# Altium project Axiom_Gamma_LSB.PrjPcb
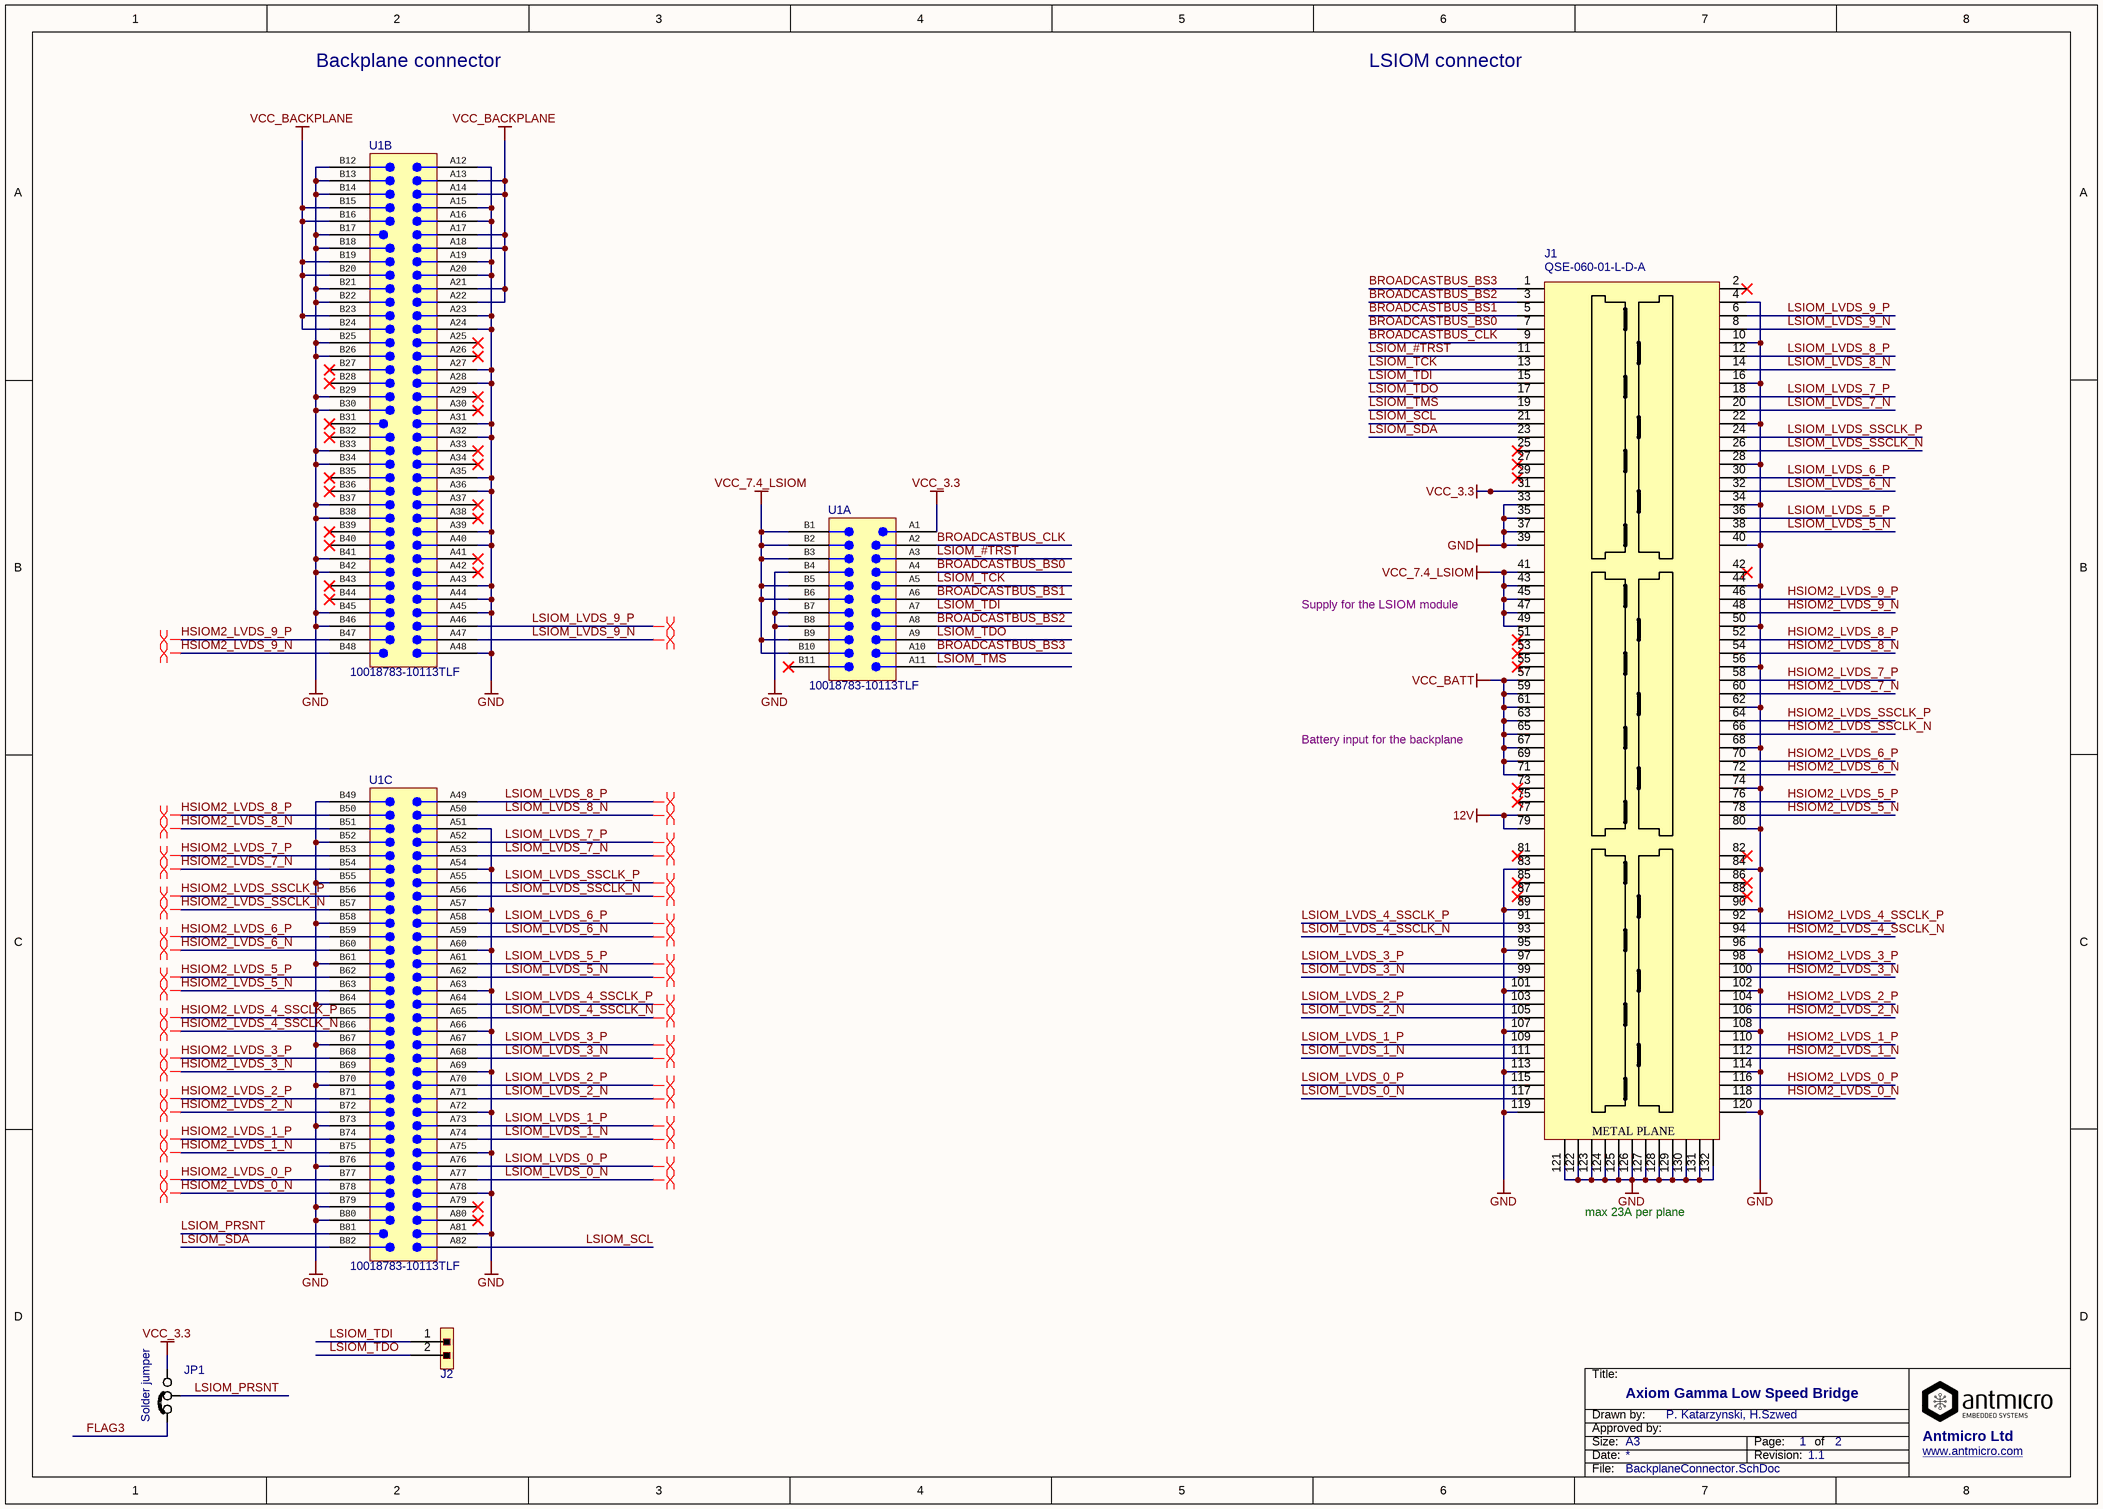
[diagram p0: BackplaneConnector.SchDoc]
AM_Title: Axiom Gamma Low Speed Bridge; AM_Revision: 1.1; AM_Author: P. Katarzynski, H.Szwed
2 sheets, 63 parts. Net scope: global (net labels, ports and power ports of the same name join across sheets).
Board file: Axiom_Gamma_LSB.PcbDoc
Sheets:
  BackplaneConnector.SchDoc
  Supply.SchDoc

## Sheet BackplaneConnector.SchDoc: =AM_Title
size A3; Author: P. Katarzynski, H.Szwed; CompanyName: Antmicro Ltd; Address1: Zwierzyniecka 3; Address2: 60-813 Poznań; Address3: Poland; Address4: 60-813 Poznań, Poland; DocumentNumber: 1; Revision: 1.1; SheetNumber: 1; SheetTotal: 2; PageSetup: Record=PageOptions|CenterHorizontal=True|CenterVertical=True|PrintScale=0.97|XCorrection=1.00|YCorrection=1.00|PrintKind=1|BorderSize=5000000|LeftOffset=0|BottomOffset=0|Orientation=2|PaperLength=2970|PaperWidth=2100|Scale=100|PaperSource=7|PrintQuality=600|MediaType=1|DitherType=10|PaperKind=A4|PrintScaleMode=1

### Parts
J1  QSE-060-01-L-D-A  [QSE-060-01-L-D-A]
J2  1x2 pinhead 2.54mm male  [HEADER_1X2_male 2.54mm Angle]  (value not drawn)
JP1  Solder jumper  [JUMPER_2WAY]  (no BOM)
U1  10018783-10113TLF  [10018783-10113TLF]  (parts A,B,C of 3)

### Nets
12V: J1.77 J1.79
GND: J1.4 J1.10 J1.16 J1.22 J1.28 J1.33 J1.34 J1.35 J1.37 J1.39 J1.40 J1.44 J1.50 J1.56 J1.62 J1.68 J1.74 J1.80 J1.83 J1.84 J1.89 J1.90 J1.95 J1.96 J1.101 J1.102 J1.107 J1.108 J1.113 J1.114 J1.119 J1.120 J1.121 J1.122 J1.123 J1.124 J1.125 J1.126 J1.127 J1.128 J1.129 J1.130 J1.131 J1.132 U1.A12 U1.A15 U1.A16 U1.A19 U1.A20 U1.A23 U1.A24 U1.A27 U1.A28 U1.A31 U1.A32 U1.A35 U1.A36 U1.A39 U1.A40 U1.A43 U1.A44 U1.A45 U1.A48 U1.A51 U1.A54 U1.A57 U1.A60 U1.A63 U1.A66 U1.A69 U1.A72 U1.A75 U1.A78 U1.A81 U1.B4 U1.B7 U1.B8 U1.B12 U1.B13 U1.B14 U1.B17 U1.B18 U1.B21 U1.B22 U1.B25 U1.B26 U1.B29 U1.B30 U1.B33 U1.B34 U1.B37 U1.B38 U1.B41 U1.B42 U1.B45 U1.B46 U1.B49 U1.B52 U1.B55 U1.B58 U1.B61 U1.B64 U1.B67 U1.B70 U1.B73 U1.B76 U1.B79 U1.B80
VCC_3.3: J1.31 JP1.3 U1.A1
VCC_7.4_LSIOM: J1.41 J1.43 J1.45 J1.47 J1.49 U1.B1 U1.B2 U1.B3 U1.B5 U1.B6 U1.B9 U1.B10
VCC_BACKPLANE: U1.A13 U1.A14 U1.A17 U1.A18 U1.A21 U1.A22 U1.B15 U1.B16 U1.B19 U1.B20 U1.B23 U1.B24
VCC_BATT: J1.57 J1.59 J1.61 J1.63 J1.65 J1.67 J1.69 J1.71
BROADCASTBUS_BS0: J1.7 U1.A4
BROADCASTBUS_BS1: J1.5 U1.A6
BROADCASTBUS_BS2: J1.3 U1.A8
BROADCASTBUS_BS3: J1.1 U1.A10
BROADCASTBUS_CLK: J1.9 U1.A2
FLAG3: JP1.1
HSIOM2_LVDS_0_N: J1.118 U1.B78
HSIOM2_LVDS_0_P: J1.116 U1.B77
HSIOM2_LVDS_1_N: J1.112 U1.B75
HSIOM2_LVDS_1_P: J1.110 U1.B74
HSIOM2_LVDS_2_N: J1.106 U1.B72
HSIOM2_LVDS_2_P: J1.104 U1.B71
HSIOM2_LVDS_3_N: J1.100 U1.B69
HSIOM2_LVDS_3_P: J1.98 U1.B68
HSIOM2_LVDS_4_SSCLK_N: J1.94 U1.B66
HSIOM2_LVDS_4_SSCLK_P: J1.92 U1.B65
HSIOM2_LVDS_5_N: J1.78 U1.B63
HSIOM2_LVDS_5_P: J1.76 U1.B62
HSIOM2_LVDS_6_N: J1.72 U1.B60
HSIOM2_LVDS_6_P: J1.70 U1.B59
HSIOM2_LVDS_7_N: J1.60 U1.B54
HSIOM2_LVDS_7_P: J1.58 U1.B53
HSIOM2_LVDS_8_N: J1.54 U1.B51
HSIOM2_LVDS_8_P: J1.52 U1.B50
HSIOM2_LVDS_9_N: J1.48 U1.B48
HSIOM2_LVDS_9_P: J1.46 U1.B47
HSIOM2_LVDS_SSCLK_N: J1.66 U1.B57
HSIOM2_LVDS_SSCLK_P: J1.64 U1.B56
LSIOM_#TRST: J1.11 U1.A3
LSIOM_LVDS_0_N: J1.117 U1.A77
LSIOM_LVDS_0_P: J1.115 U1.A76
LSIOM_LVDS_1_N: J1.111 U1.A74
LSIOM_LVDS_1_P: J1.109 U1.A73
LSIOM_LVDS_2_N: J1.105 U1.A71
LSIOM_LVDS_2_P: J1.103 U1.A70
LSIOM_LVDS_3_N: J1.99 U1.A68
LSIOM_LVDS_3_P: J1.97 U1.A67
LSIOM_LVDS_4_SSCLK_N: J1.93 U1.A65
LSIOM_LVDS_4_SSCLK_P: J1.91 U1.A64
LSIOM_LVDS_5_N: J1.38 U1.A62
LSIOM_LVDS_5_P: J1.36 U1.A61
LSIOM_LVDS_6_N: J1.32 U1.A59
LSIOM_LVDS_6_P: J1.30 U1.A58
LSIOM_LVDS_7_N: J1.20 U1.A53
LSIOM_LVDS_7_P: J1.18 U1.A52
LSIOM_LVDS_8_N: J1.14 U1.A50
LSIOM_LVDS_8_P: J1.12 U1.A49
LSIOM_LVDS_9_N: J1.8 U1.A47
LSIOM_LVDS_9_P: J1.6 U1.A46
LSIOM_LVDS_SSCLK_N: J1.26 U1.A56
LSIOM_LVDS_SSCLK_P: J1.24 U1.A55
LSIOM_PRSNT: JP1.2 U1.B81
LSIOM_SCL: J1.21 U1.A82
LSIOM_SDA: J1.23 U1.B82
LSIOM_TCK: J1.13 U1.A5
LSIOM_TDI: J1.15 J2.1 U1.A7
LSIOM_TDO: J1.17 J2.2 U1.A9
LSIOM_TMS: J1.19 U1.A11

Not connected (* = marked no-connect by the designer): J1 2* 25* 27* 29* 42* 51* 53* 55* 73* 75* 81* 82* 85* 86* 87* 88*; U1 A25* A26* A29* A30* A33* A34* A37* A38* A41* A42* A79* A80* B11* B27* B28* B31* B32* B35* B36* B39* B40* B43* B44*

### Layout directives
differential pair; net class LSIOM_LVDS: HSIOM2_LVDS_0_N, HSIOM2_LVDS_0_P, HSIOM2_LVDS_1_N, HSIOM2_LVDS_1_P, HSIOM2_LVDS_2_N, HSIOM2_LVDS_2_P, HSIOM2_LVDS_3_N, HSIOM2_LVDS_3_P, HSIOM2_LVDS_4_SSCLK_N, HSIOM2_LVDS_4_SSCLK_P, HSIOM2_LVDS_5_N, HSIOM2_LVDS_5_P, HSIOM2_LVDS_6_N, HSIOM2_LVDS_6_P, HSIOM2_LVDS_7_N, HSIOM2_LVDS_7_P, HSIOM2_LVDS_8_N, HSIOM2_LVDS_8_P, HSIOM2_LVDS_9_N, HSIOM2_LVDS_9_P, HSIOM2_LVDS_SSCLK_N, HSIOM2_LVDS_SSCLK_P, LSIOM_LVDS_0_N, LSIOM_LVDS_0_P, LSIOM_LVDS_1_N, LSIOM_LVDS_1_P, LSIOM_LVDS_2_N, LSIOM_LVDS_2_P, LSIOM_LVDS_3_N, LSIOM_LVDS_3_P, LSIOM_LVDS_4_SSCLK_N, LSIOM_LVDS_4_SSCLK_P, LSIOM_LVDS_5_N, LSIOM_LVDS_5_P, LSIOM_LVDS_6_N, LSIOM_LVDS_6_P, LSIOM_LVDS_7_N, LSIOM_LVDS_7_P, LSIOM_LVDS_8_N, LSIOM_LVDS_8_P, LSIOM_LVDS_SSCLK_N, LSIOM_LVDS_SSCLK_P
differential pair: LSIOM_LVDS_9_N, LSIOM_LVDS_9_P

### Notes on the sheet
- Backplane connector
- LSIOM connector
- Supply for the LSIOM module
- Battery input for the backplane
- max 23A per plane
- Title:
- Drawn by:
- Size:
- Date:
- Approved by:
- A3
- Revision:
- Page:
- of
- www.antmicro.com
- File:
- (in symbol QSE-060-01-L-D-A) METAL PLANE

### Library data of the parts
J1 = QSE-060-01-L-D-A: SAMTEC 	QSE-60-01-L-D-A  Stacking Board Connector, Dual Row, QSE Series, Receptacle, 0.8 m, 120 Contacts, Surface Mount; Part Number: QSE-060-01-L-D-A; Value: QSE-060-01-L-D-A; Manufacturer: SAMTEC; Part Symbol: QSE-060-01-L-D-A
J2 = HEADER_1X2_male_angle: 1x2 pinhead male angle; Manufacturer: MULTICOMP; Value: 2211S-02G; Part Number: HEADER_1X2_male_angle; Part Symbol: 2211S-02G
JP1 = Jumper 2 way: Value: Solder
U1 = 10018783-10113TLF: PCI Express x16 164 2.36 mm; Manufacturer: AMPHENOL; Part Symbol: 10018783-10113TLF; Part Number: 10018783-10113TLF; Value: 10018783-10113TLF

## Sheet Supply.SchDoc: =AM_Title
size A3; Author: P. Katarzynski, H.Szwed; CompanyName: Antmicro Ltd; Address1: Zwierzyniecka 3; Address2: 60-813 Poznań; Address3: Poland; Address4: 60-813 Poznań, Poland; DocumentNumber: 2; Revision: 1.1; SheetNumber: 2; SheetTotal: 2; PageSetup: Record=PageOptions|CenterHorizontal=True|CenterVertical=True|PrintScale=0.97|XCorrection=1.00|YCorrection=1.00|PrintKind=1|BorderSize=5000000|LeftOffset=0|BottomOffset=0|Orientation=2|PaperLength=2970|PaperWidth=2100|Scale=100|PaperSource=7|PrintQuality=600|MediaType=1|DitherType=10|PaperKind=A4|PrintScaleMode=1
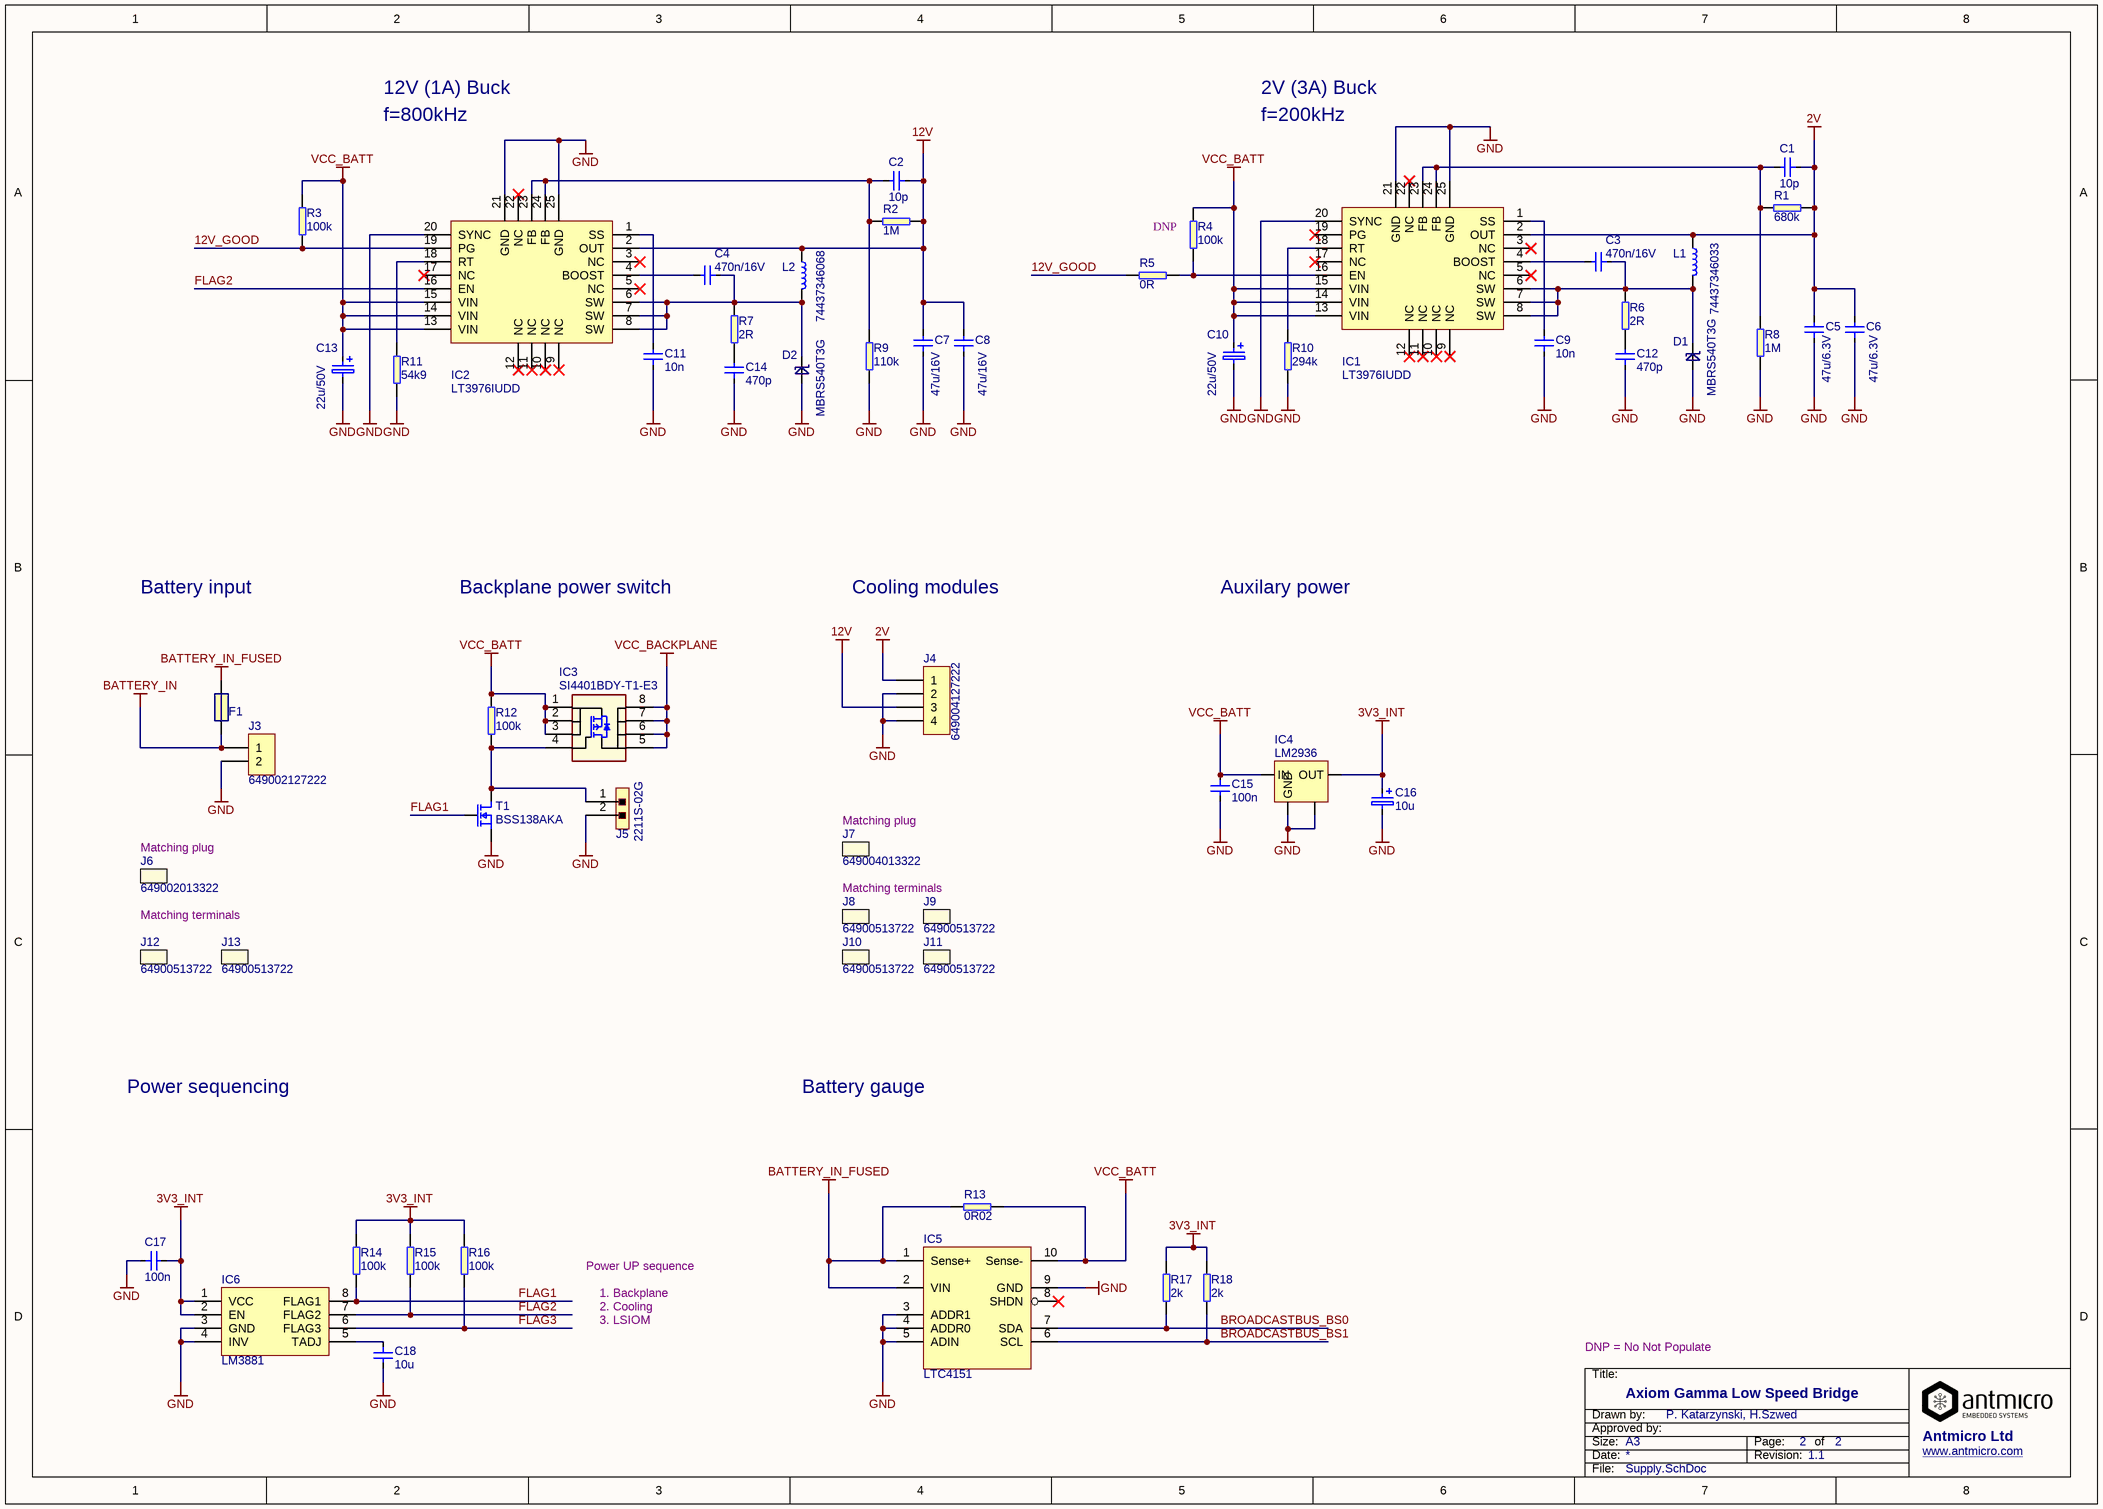
[diagram p1: Supply.SchDoc]

### Parts
C1  10p  [0402]
C2  10p  [0402]
C3  470n/16V  [0402]
C4  470n/16V  [0402]
C5  47u/6.3V  [1206]
C6  47u/6.3V  [1206]
C7  47u/16V  [1206]
C8  47u/16V  [1206]
C9  10n  [0402]
C10  22u/50V  [KEMET_X]
C11  10n  [0402]
C12  470p  [0402]
C13  22u/50V  [KEMET_X]
C14  470p  [0402]
C15  100n  [0603]
C16  10u  [KEMET_A]
C17  100n  [0603]
C18  10u  [0603]
D1  MBRS540T3G  [SMC-403-03]
D2  MBRS540T3G  [SMC-403-03]
F1  MC12CF  [1206]  (value not drawn)
IC1  LT3976IUDD  [QFN-24_3x5mm]
IC2  LT3976IUDD  [QFN-24_3x5mm]
IC3  SI4401BDY-T1-E3  [SOIC-SN8_M]
IC4  LM2936  [SOT223]
IC5  LTC4151  [MSOP10]
IC6  LM3881  [MSOP-8]
J3  649002127222  [WE_649002127222]
J4  649004127222  [WE_649004127222]
J5  value 2211S-02G  [HEADER_1X2_male 2.54mm Angle]  (hidden comment: 1x2 pinhead 2.54mm male)
J6  649002013322  (mechanical)
J7  649004013322  (mechanical)
J8  64900513722  (mechanical)
J9  64900513722  (mechanical)
J10  64900513722  (mechanical)
J11  64900513722  (mechanical)
J12  64900513722  (mechanical)
J13  64900513722  (mechanical)
L1  74437346033  [WE-LHMI]
L2  74437346068  [WE-LHMI]
R1  680k  [0402]
R2  1M  [0603]
R3  100k  [0603]
R4  100k  [0603]
R5  0R  [0603]
R6  2R  [0402]
R7  2R  [0402]
R8  1M  [0603]
R9  110k  [0603]
R10  294k  [0402]
R11  54k9  [0402]
R12  100k  [0603]
R13  0R02  [2512]
R14  100k  [0603]
R15  100k  [0603]
R16  100k  [0603]
R17  2k  [0603]
R18  2k  [0603]
T1  BSS138AKA  [SOT-23]

### Nets
2V: C1.1 C5.2 C6.2 IC1.2(OUT) J4.1 L1.2 R1.2
3V3_INT: C16.1 C17.2 IC4.3(OUT) IC6.1(VCC) IC6.2(EN) R14.2 R15.2 R16.2 R17.2 R18.2
12V: C2.1 C7.2 C8.2 IC2.2(OUT) J4.3 L2.2 R2.1
BATTERY_IN: F1.1 J3.1
BATTERY_IN_FUSED: F1.2 IC5.1(Sense+) IC5.2(VIN) R13.1
GND: C5.1 C6.1 C7.1 C8.1 C9.1 C10.2 C11.1 C12.1 C13.2 C14.1 C15.2 C16.2 C17.1 C18.2 D1.A D2.A IC1.20(SYNC) IC1.21(GND) IC1.25(GND) IC2.20(SYNC) IC2.21(GND) IC2.25(GND) IC4.2(GND) IC4.4(GND) IC5.3(ADDR1) IC5.4(ADDR0) IC5.5(ADIN) IC5.9(GND) IC6.3(GND) IC6.4(INV) J3.2 J4.2 J4.4 J5.2 R8.2 R9.1 R10.1 R11.1 T1.2(S)
VCC_BACKPLANE: IC3.5 IC3.6 IC3.7 IC3.8
VCC_BATT: C10.1 C13.1 C15.1 IC1.13(VIN) IC1.14(VIN) IC1.15(VIN) IC2.13(VIN) IC2.14(VIN) IC2.15(VIN) IC3.1 IC3.2 IC3.3 IC4.1(IN) IC5.10(Sense-) R3.2 R4.2 R12.2 R13.2
12V_GOOD: IC2.19(PG) R3.1 R5.1
BROADCASTBUS_BS0: IC5.7(SDA) R17.1
BROADCASTBUS_BS1: IC5.6(SCL) R18.1
FLAG1: IC6.8(FLAG1) R14.1 T1.1(G)
FLAG2: IC2.16(EN) IC6.7(FLAG2) R15.1
FLAG3: IC6.6(FLAG3) R16.1
NetC1_2: C1.2 IC1.23(FB) IC1.24(FB) R1.1 R8.1
NetC2_2: C2.2 IC2.23(FB) IC2.24(FB) R2.2 R9.2
NetC3_1: C3.1 D1.C IC1.6(SW) IC1.7(SW) IC1.8(SW) L1.1 R6.2
NetC3_2: C3.2 IC1.4(BOOST)
NetC4_1: C4.1 D2.C IC2.6(SW) IC2.7(SW) IC2.8(SW) L2.1 R7.2
NetC4_2: C4.2 IC2.4(BOOST)
NetC9_2: C9.2 IC1.1(SS)
NetC11_2: C11.2 IC2.1(SS)
NetC12_2: C12.2 R6.1
NetC14_2: C14.2 R7.1
NetC18_1: C18.1 IC6.5(TADJ)
NetIC1_16: IC1.16(EN) R4.1 R5.2
NetIC1_18: IC1.18(RT) R10.2
NetIC2_18: IC2.18(RT) R11.2
NetIC3_4: IC3.4 J5.1 R12.1 T1.3(D)

Not connected (* = marked no-connect by the designer): IC1 3(NC)* 5(NC)* 9(NC)* 10(NC)* 11(NC)* 12(NC)* 17(NC)* 19(PG)* 22(NC)*; IC2 3(NC)* 5(NC)* 9(NC)* 10(NC)* 11(NC)* 12(NC)* 17(NC)* 22(NC)*; IC5 8(SHDN)*

### Notes on the sheet
- 12V (1A) Buck
- 2V (3A) Buck
- f=800kHz
- f=200kHz
- (near R4) DNP
- Battery input
- Backplane power switch
- Cooling modules
- Auxilary power
- (near J6) Matching plug
- (near J7) Matching plug
- Matching terminals
- Power sequencing
- Battery gauge
- Power UP sequence
- 1. Backplane
- 2. Cooling
- 3. LSIOM
- DNP = No Not Populate
- Title:
- Drawn by:
- Size:
- Date:
- Approved by:
- A3
- Revision:
- Page:
- of
- www.antmicro.com
- File:

### Library data of the parts
C1-C4 C9 C11 C12 C14 = C_0402: MLCC SMT Capacitor 0402; Part Number: C_10n_0402; Manufacturer: AVX; Part Symbol: 04025G103ZAT2A
  C1 C2: Value: 10p
  C3 C4: Value: 470n/16V
  C9 C11: Value: 10n
  C12 C14: Value: 470p
C5-C8 = C_1206: MLCC SMT Capacitor 1206; Part Number: C_47u_1206; Manufacturer: MURATA; Part Symbol: GRM31CC80J476KE18L
  C5 C6: Value: 47u/6.3V
  C7 C8: Value: 47u/16V
C10 C13 = CPol_X: Tantalum SMT Capacitor Case KEMET_X; Part Number: C_22u_KEMET_X; Manufacturer: KEMET; Part Symbol: T491X226K050AT; Value: 22u/50V
C15 C17 C18 = C_0603: MLCC SMT Capacitor  0603; Part Number: C_10u_0603; Manufacturer: MULTICOMP; Part Symbol: MC0603X106M6R3CT
  C15 C17: Value: 100n
  C18: Value: 10u
C16 = CPol_A: Tantalum SMT Capacitor Case KEMET_A; Part Number: C_10u_KEMET_A; Manufacturer: VISHAY; Part Symbol: 293D106X9016A2TE3; Value: 10u
D1 D2 = MBRS540T3G: ON SEMICONDUCTOR  MBRS540T3G  Rectifier Diode, Single, 40 V, 5 A, 500 mV, 190 A, 150 °C; Part Number: MBRS540T3G; Value: MBRS540T3G; Manufacturer: ON SEMICONDUCTOR; Part Symbol: MBRS540T3G
F1 = MC12CF: MULTICOMP  MC12CF 005  Fuse, Surface Mount, 12CF Series, 5 A, 32 VAC, 63 VDC, Very Fast Acting, 1206; Part Number: MC12CF; Value: MC12CF; Manufacturer: MULTICOMP; Part Symbol: MC12CF
IC1 IC2 = LT3976IUDD: LINEAR TECHNOLOGY  LT3976IUDD#PBF  DC-DC Switching Buck (Step Down) Regulator, Adjustable, 4.3V-40Vin, 1.2V-39.2Vout, 5Aout, QFN-24; Part Number: LT3976IUDD; Value: LT3976IUDD; Manufacturer: LINEAR TECHNOLOGY; Part Symbol: LT3976IUDD#PBF
IC3 = SI4401BDY-T1-E3: VISHAY  SI4401BDY-T1-E3  MOSFET Transistor, P Channel, -8.7 A, -40 V, 0.011 ohm, -10 V, -3 V; Part Number: SI4401BDY-T1-E3; Value: SI4401BDY-T1-E3; Manufacturer: VISHAY; Part Symbol: SI4401BDY-T1-E3
IC4 = LM2936: TEXAS INSTRUMENTS  LM2936MP-3.3/NOPB  Fixed LDO Voltage Regulator, 5.5V to 40V, 200mV Dropout, 3.3Vout, 50mAout, SOT-223-3; Value: LM2936; Part Number: LM2936; Manufacturer: TEXAS INSTRUMENTS; Part Symbol: LM2936MP-3.3/NOPB
IC5 = LTC4151: LINEAR TECHNOLOGY  LTC4151IMS-1#PBF  High Voltage I2C Current and Voltage Monitor, 7V-80Vin, MSOP-10; Part Number: LTC4151; Value: LTC4151; Manufacturer: LINEAR TECHNOLOGY; Part Symbol: LTC4151IMS-1#PBF
IC6 = LM3881: TEXAS INSTRUMENTS  LM3881MME/NOPB  Power Sequencer, 3-Monitors, 2.7V-5.5Vin,VSSOP-8; Part Number: LM3881; Value: LM3881; Manufacturer: TEXAS INSTRUMENTS; Part Symbol: LM3881MME
J3 = WE_649002127222: 4.20mm Male Single Row Angled Header w. Mounting Pegs WR-MPC4; Manufacturer: WURTH ELEKTRONIC; Part Number: WE_649002127222; Value: WE_649002127222; Part Symbol: 649002127222
J4 = WE_649004127222: 4.20mm Male Single Row Angled Header w. Mounting Pegs WR-MPC4; Manufacturer: WURTH ELEKTRONIC; Part Number: WE_649004127222; Value: WE_649004127222; Part Symbol: 649004127222
J5 = HEADER_1X2_male_angle: 1x2 pinhead male angle; Part Number: HEADER_1X2_male_angle; Part Symbol: 2211S-02G
J6-J13 = GENERIC_BOM_ONLY: Manufacturer: Wuerth Elektronik
  J6: Part Number: 649002013322; Value: 649002013322; Part Symbol: 649002013322
  J7: Part Number: 649004013322; Value: 649004013322; Part Symbol: 649004013322
  J8-J13: Part Number: 64900513722; Value: 64900513722; Part Symbol: 64900513722
L1 = Wurth-74437346033: 3.3 uH, 5.0A, 0.03 ohm, SMD Power Inductor; Manufacturer: WURTH ELEKTRONIK; Part Number: Wurth-74437346033; Value: 74437346033; Part Symbol: 74437346033
L2 = Wurth-74437346068: 6.8 uH, 3.4A, 0.054 ohm, SMD Power Inductor; Manufacturer: WURTH ELEKTRONIK; Part Number: Wurth-74437346068; Value: 74437346068; Part Symbol: 74437346068
R1 R6 R7 R10 R11 = R_0402: SMT Resistor 0402; Part Number: R_2R_0402; Manufacturer: MULTICOMP; Part Symbol: MC00625W040212R0
  R1: Value: 680k
  R6 R7: Value: 2R
  R10: Value: 294k
  R11: Value: 54k9
R2-R5 R8 R9 R12 R14-R18 = R_0603: SMT Resistor 0603; Part Number: R_1M_0603_0.1%; Manufacturer: TE; Part Symbol: CPF0603B1M0E
  R2 R8: Value: 1M
  R3 R4 R12 R14-R16: Value: 100k
  R5: Value: 0R
  R9: Value: 110k
  R17 R18: Value: 2k
R13 = R_2512: SMT Resistor 2512; Part Number: R_0R02_2512; Manufacturer: BOURNS; Part Symbol: CRA2512-FZ-R020ELF / CRA2512-FZ-R020ELF / CRA2512-FZ-R020ELF; Value: 0R02
T1 = BSS138: MOSFET, N CH, 60V, 0.2A; Part Number: BSS138; Manufacturer: NXP; Value: BSS138AKA; Part Symbol: BSS138AKA

## Nets that join several sheets
12V: BackplaneConnector (J1.77 J1.79), Supply (7 pins)
GND: BackplaneConnector (108 pins), Supply (39 pins)
VCC_BACKPLANE: BackplaneConnector (12 pins), Supply (IC3.5 IC3.6 IC3.7 IC3.8)
VCC_BATT: BackplaneConnector (8 pins), Supply (18 pins)
BROADCASTBUS_BS0: BackplaneConnector (J1.7 U1.A4), Supply (IC5.7 R17.1)
BROADCASTBUS_BS1: BackplaneConnector (J1.5 U1.A6), Supply (IC5.6 R18.1)
FLAG3: BackplaneConnector (JP1.1), Supply (IC6.6 R16.1)